# Altium schematic sheet Etapas_Parte1.SchDoc
size A4
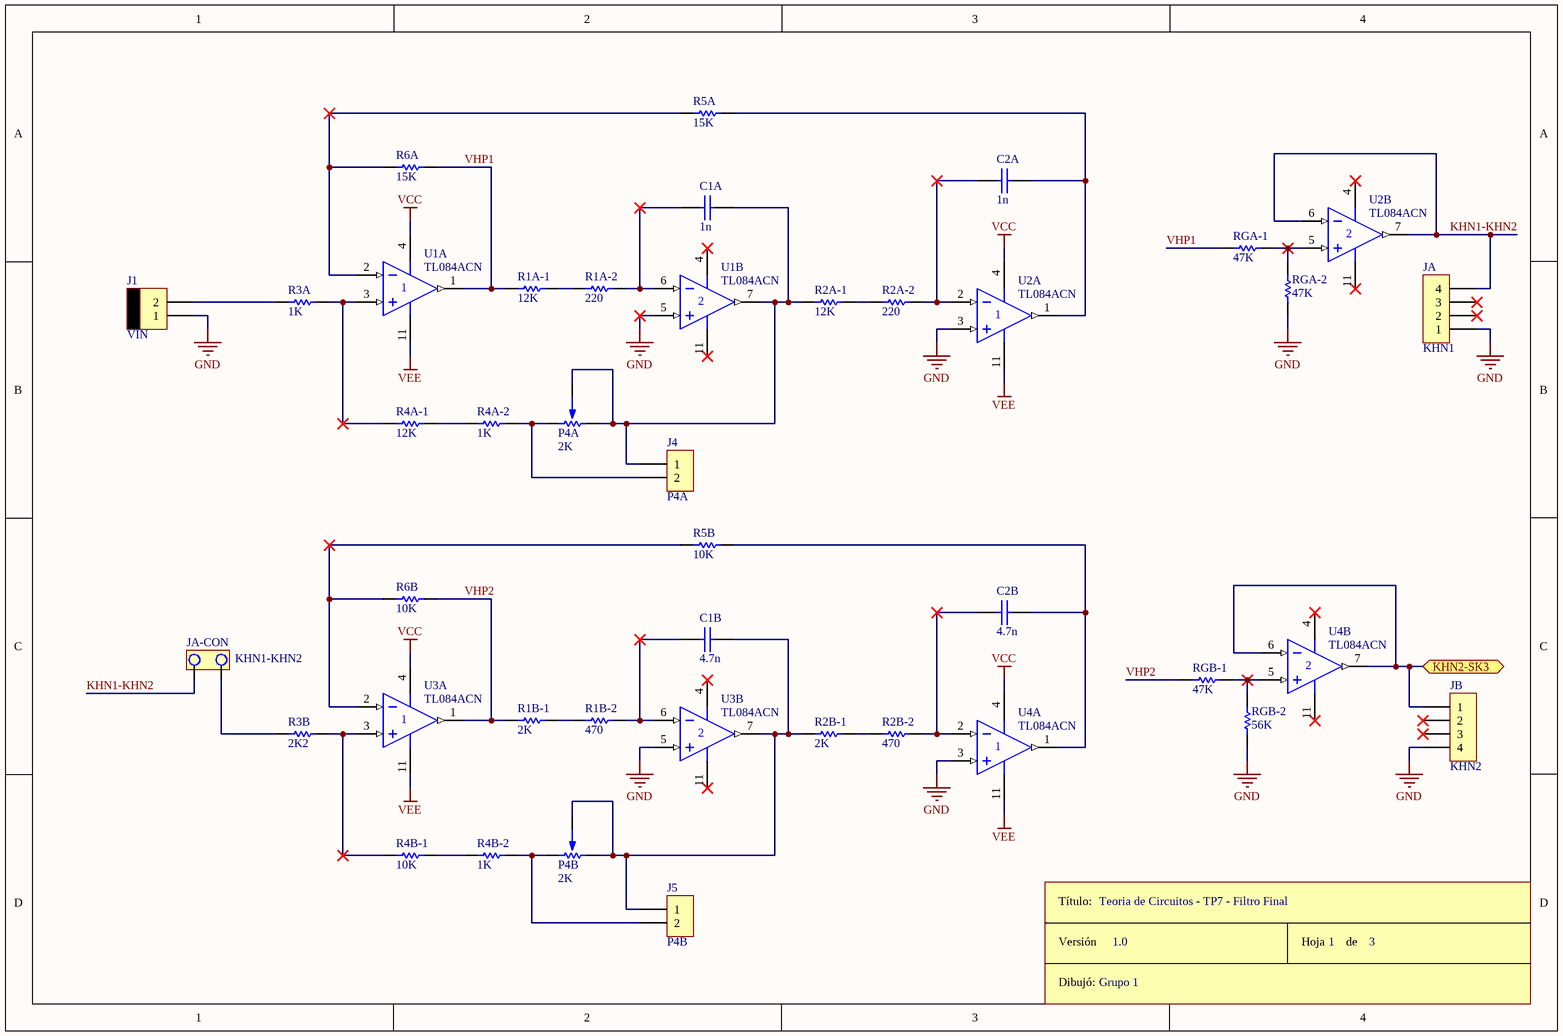
[diagram p0: Etapas_Parte1.SchDoc]

## Parts
C1A  1n  [CAP200]
C1B  4.7n  [CAP200]
C2A  1n  [CAP200]
C2B  4.7n  [CAP200]
J1  VIN  [MOLEX2]
J4  P4A  [SIP2]
J5  P4B  [SIP2]
JA  KHN1  [SIP4]
JA-CON  KHN1-KHN2  [JUMPER2]
JB  KHN2  [SIP4]
P4A  2K  [PRESET V]
P4B  2K  [PRESET V]
R1A-1  12K  [RES400]
R1A-2  220  [RES400]
R1B-1  2K  [RES400]
R1B-2  470  [RES400]
R2A-1  12K  [RES400]
R2A-2  220  [RES400]
R2B-1  2K  [RES400]
R2B-2  470  [RES400]
R3A  1K  [RES400]
R3B  2K2  [RES400]
R4A-1  12K  [RES400]
R4A-2  1K  [RES400]
R4B-1  10K  [RES400]
R4B-2  1K  [RES400]
R5A  15K  [RES400]
R5B  10K  [RES400]
R6A  15K  [RES400]
R6B  10K  [RES400]
RGA-1  47K  [RES400]
RGA-2  47K  [RES400]
RGB-1  47K  [RES400]
RGB-2  56K  [RES400]
ROT1  Rótulo  (value not drawn)
U1  TL084ACN  [646-06]  (parts A,B of 4)
U2  TL084ACN  [646-06]  (parts A,B of 4)
U3  TL084ACN  [646-06]  (parts A,B of 4)
U4  TL084ACN  [646-06]  (parts A,B of 4)

## Ports
KHN2-SK3

## Nets
GND: J1.1 JA.1 JB.4 RGA-2.1 RGB-2.1 U1.5(IN+) U2.3(IN+) U3.5(IN+) U4.3(IN+)
VCC: U1.4(V+) U2.4(V+) U3.4(V+) U4.4(V+)
VEE: U1.11(V-) U2.11(V-) U3.11(V-) U4.11(V-)
KHN1-KHN2: JA.4 JA-CON.2 U2.6(IN-) U2.7(OUT)
KHN2-SK3: JB.1 U4.6(IN-) U4.7(OUT) ; port KHN2-SK3
VHP1: R1A-1.1 R6A.2 RGA-1.1 U1.1(OUT)
VHP2: R1B-1.1 R6B.2 RGB-1.1 U3.1(OUT)
NetC1A_1: C1A.1 R1A-2.2 U1.6(IN-)
NetC1A_2: C1A.2 J4.1 P4A.2 P4A.3 R2A-1.1 U1.7(OUT)
NetC1B_1: C1B.1 R1B-2.2 U3.6(IN-)
NetC1B_2: C1B.2 J5.1 P4B.2 P4B.3 R2B-1.1 U3.7(OUT)
NetC2A_1: C2A.1 R2A-2.2 U2.2(IN-)
NetC2A_2: C2A.2 R5A.2 U2.1(OUT)
NetC2B_1: C2B.1 R2B-2.2 U4.2(IN-)
NetC2B_2: C2B.2 R5B.2 U4.1(OUT)
NetJ1_2: J1.2 R3A.1
NetJ4_2: J4.2 P4A.1 R4A-2.2
NetJ5_2: J5.2 P4B.1 R4B-2.2
NetJA-CON_1: JA-CON.1 R3B.2
NetR1A-1_2: R1A-1.2 R1A-2.1
NetR1B-1_2: R1B-1.2 R1B-2.1
NetR2A-1_2: R2A-1.2 R2A-2.1
NetR2B-1_2: R2B-1.2 R2B-2.1
NetR3A_2: R3A.2 R4A-1.1 U1.3(IN+)
NetR3B_1: R3B.1 R4B-1.1 U3.3(IN+)
NetR4A-1_2: R4A-1.2 R4A-2.1
NetR4B-1_2: R4B-1.2 R4B-2.1
NetR5A_1: R5A.1 R6A.1 U1.2(IN-)
NetR5B_1: R5B.1 R6B.1 U3.2(IN-)
NetRGA-1_2: RGA-1.2 RGA-2.2 U2.5(IN+)
NetRGB-1_2: RGB-1.2 RGB-2.2 U4.5(IN+)

Not connected (* = marked no-connect by the designer): JA 2* 3*; JB 2* 3*

## Notes on the sheet
- Teoria de Circuitos - TP7 - Filtro Final
- Grupo 1
- 1.0
- 1
- 3
- (in symbol Rótulo) Título:; Versión; Hoja       de; Dibujó:

## Library data of the parts
C1A C1B C2A C2B = CAP
J1 = MOLEX2
J4 J5 = CON2
JA JB = CON4
JA-CON = JUMPER
P4A P4B = PRESET
R1A-1 R1A-2 R1B-1 R1B-2 R2A-1 R2A-2 R2B-1 R2B-2 R3A R3B R4A-1 R4A-2 R4B-1 R4B-2 R5A R5B R6A R6B RGA-1 RGA-2 RGB-1 RGB-2 = RES
U1-U4 = TL084ACN: JFET-Input Operational Amplifier; Published: 17-Jul-2002; LatestRevisionDate: 06-Jun-2005; LatestRevisionNote: Stylized 3D Model Added.; DatasheetVersion: 1988; PackageVersion: 1997; PackageReference: 646-06; Publisher: Altium Limited; PackageDescription: DIP; 14 Leads; Row Spacing 7.62 mm; Pitch 2.54 mm; ComponentLink1Description: Manufacturer Link; ComponentLink1URL: http://www.onsemi.com/site/products/parametrics/0,4446,251,00.html